# EAGLE design MorpheusMotor_1_1_0_AsFixed (EAGLE 5.11)
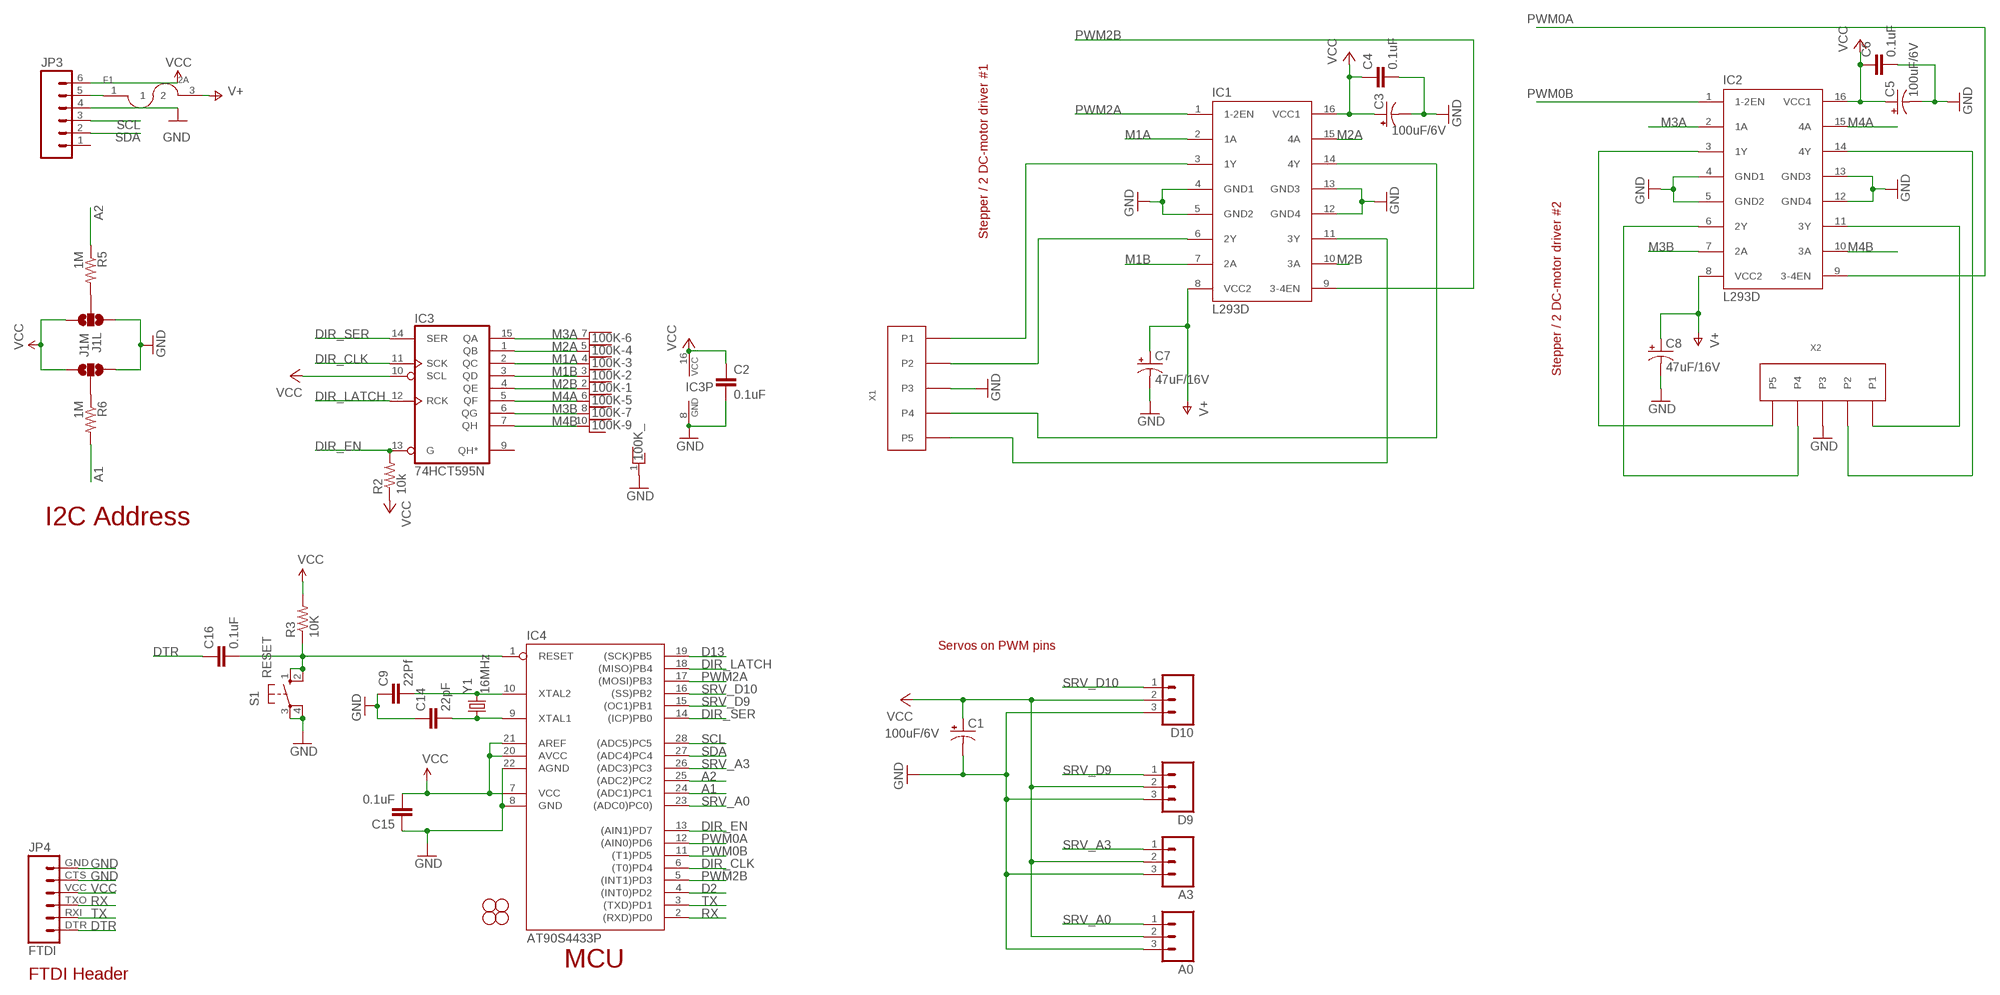
[diagram p0: schematic, sheet 1]

## Parts
100K  RNX9  [RN-10]
A0  M03PTH  [1X03]
A3  M03PTH  [1X03]
C1  100uF/6V  CAP_POLPTH1  [CPOL-RADIAL-100UF-25V]
C2  0.1uF  CAPPTH  [CAP-PTH-SMALL]
C3  100uF/6V  CAP_POLPTH1  [CPOL-RADIAL-100UF-25V]
C4  0.1uF  CAPPTH  [CAP-PTH-SMALL]
C5  100uF/6V  CAP_POLPTH1  [CPOL-RADIAL-100UF-25V]
C6  0.1uF  CAPPTH  [CAP-PTH-SMALL]
C7  47uF/16V  CAP_POLPTH1  [CPOL-RADIAL-100UF-25V]
C8  47uF/16V  CAP_POLPTH1  [CPOL-RADIAL-100UF-25V]
C9  22Pf  CAPPTH  [CAP-PTH-SMALL]
C14  22pF  CAPPTH  [CAP-PTH-SMALL]
C15  0.1uF  CAPPTH  [CAP-PTH-SMALL]
C16  0.1uF  CAPPTH  [CAP-PTH-SMALL]
D9  M03PTH  [1X03]
D10  M03PTH  [1X03]
F1  2A  FUSEX20MM  [FUSE_5MM]
IC1  L293D  L293E  [DIL16]
IC2  L293D  L293E  [DIL16]
IC3  74HCT595N  [DIL16]
IC4  AT90S4433P  [DIL28-3]
J1L  SOLDERJUMPER_2WAY-OLDT  [SJ_2]
J1M  SOLDERJUMPER_2WAY-OLDT  [SJ_2]
JP3  M06POLAR_LOCK  [MOLEX-1X6_LOCK]
JP4  FTDI  FTDI_BASICPTH  [FTDI_BASIC]
JP5  STAND-OFF  [STAND-OFF]
JP7  STAND-OFF  [STAND-OFF]
JP8  STAND-OFF  [STAND-OFF]
JP9  STAND-OFF  [STAND-OFF]
R2  10k  RESISTORPTH-1/4W  [AXIAL-0.4]
R3  10K  RESISTORPTH-1/4W  [AXIAL-0.4]
R5  1M  RESISTORPTH-1/4W  [AXIAL-0.4]
R6  1M  RESISTORPTH-1/4W  [AXIAL-0.4]
S1  RESET  10-XX  [B3F-10XX]
X1  TERM5  [TERM1X5]
X2  TERM5  [TERM1X5]
Y1  16MHz  CRYSTALHC49US  [HC49US]

## Nets
A1: IC4.24((ADC1)PC1) R6.P$2
A2: IC4.25((ADC2)PC2) R5.P$1
D2: IC4.4((INT0)PD2)
D13: IC4.19((SCK)PB5)
DIR_CLK: IC3.11(SCK) IC4.6((T0)PD4)
DIR_EN: IC3.13(G) IC4.13((AIN1)PD7) R2.P$2
DIR_LATCH: IC3.12(RCK) IC4.18((MISO)PB4)
DIR_SER: IC3.14(SER) IC4.14((ICP)PB0)
DTR: C16.1 JP4.DTR
GND [power]: 100K.1 A0.3 A3.3 C1.2(-) C2.2 C3.2(-) C4.2 C5.2(-) C6.2 C7.2(-) C8.2(-) C9.1 C14.1 C15.1 D9.3 D10.3 IC1.4(GND1) IC1.5(GND2) IC1.12(GND4) IC1.13(GND3) IC2.4(GND1) IC2.5(GND2) IC2.12(GND4) IC2.13(GND3) IC3.8(GND) IC4.8(GND) IC4.22(AGND) J1L.1 J1M.3 JP3.4 JP4.CTS JP4.GND S1.3(P) S1.4(P1) X1.P3 X2.P3
M1A: 100K.4 IC1.2(1A) IC3.2(QC)
M1B: 100K.3 IC1.7(2A) IC3.3(QD)
M2A: 100K.5 IC1.15(4A) IC3.1(QB)
M2B: 100K.2 IC1.10(3A) IC3.4(QE)
M3A: 100K.7 IC2.2(1A) IC3.15(QA)
M3B: 100K.8 IC2.7(2A) IC3.6(QG)
M4A: 100K.6 IC2.15(4A) IC3.5(QF)
M4B: 100K.10 IC2.10(3A) IC3.7(QH)
N$1 [power]: IC1.3(1Y) X1.P1
N$2: C16.2 IC4.1(RESET) R3.P$1 S1.1(S) S1.2(S1)
N$3: F1.1 JP3.5
N$4: J1L.2 R5.P$2
N$6: J1M.2 R6.P$1
N$7 [power]: IC2.3(1Y) X2.P5
N$8 [power]: IC2.6(2Y) X2.P4
N$9 [power]: IC2.11(3Y) X2.P1
N$20 [power]: IC2.14(4Y) X2.P2
N$31 [power]: IC1.6(2Y) X1.P2
N$32 [power]: IC1.11(3Y) X1.P5
N$33 [power]: IC1.14(4Y) X1.P4
PWM0A: IC2.9(3-4EN) IC4.12((AIN0)PD6)
PWM0B: IC2.1(1-2EN) IC4.11((T1)PD5)
PWM2A: IC1.1(1-2EN) IC4.17((MOSI)PB3)
PWM2B: IC1.9(3-4EN) IC4.5((INT1)PD3)
RX: IC4.2((RXD)PD0) JP4.TXO
SCL: IC4.28((ADC5)PC5) JP3.3
SDA: IC4.27((ADC4)PC4) JP3.2
SRV_A0: A0.1 IC4.23((ADC0)PC0))
SRV_A3: A3.1 IC4.26((ADC3)PC3)
SRV_D9: D9.1 IC4.15((OC1)PB1)
SRV_D10: D10.1 IC4.16((SS)PB2)
TX: IC4.3((TXD)PD1) JP4.RXI
V+ [power]: C7.1(+) C8.1(+) F1.3 IC1.8(VCC2) IC2.8(VCC2)
VCC [power]: A0.2 A3.2 C1.1(+) C2.1 C3.1(+) C4.1 C5.1(+) C6.1 C15.2 D9.2 D10.2 IC1.16(VCC1) IC2.16(VCC1) IC3.10(SCL) IC3.16(VCC) IC4.7(VCC) IC4.20(AVCC) IC4.21(AREF) J1L.3 J1M.1 JP3.6 JP4.VCC R2.P$1 R3.P$2
XTAL1: C14.2 IC4.9(XTAL1) Y1.1
XTAL2: C9.2 IC4.10(XTAL2) Y1.2
Unconnected: 100K.9 IC3.9(QH*) JP3.1

## Notes on the sheet
- Stepper / 2 DC-motor driver #1
- Stepper / 2 DC-motor driver #2
- I2C Address
- Servos on PWM pins
- MCU
- FTDI Header

## Library data of the parts
100K = resistor-net:RNX9: RESISTOR NETWORK
A0 A3 D9 D10 = SparkFun:M03: Header 3 Standard 3-pin 0.1" header. Use with straight break away headers (SKU : PRT-00116), right angle break away headers (PRT-00553), swiss pins (PRT-00743), machine pins (PRT-00117), and female headers (PRT-00115). Molex polarized connector foot print use with SKU : PRT-08232 with associated crimp pins and housings.
C1 C3 C5 C7 C8 = SparkFun:CAP_POL: Capacitor Polarized These are standard SMD and PTH capacitors. Normally 10uF, 47uF, and 100uF in electrolytic and tantalum varieties. Always verify the external diameter of the through hole cap, it varies with capacity, voltage, and manufacturer. The EIA devices should be standard.
C2 C4 C6 C9 C14-C16 = SparkFun:CAP: Capacitor Standard 0603 ceramic capacitor, and 0.1" leaded capacitor.
F1 = SparkFun:FUSE
IC1 IC2 = texas:L293E: TI DEVICE
IC3 = 74xx-eu:74*595: 8-bit SHIFT REGISTER, output latch
IC4 = atmel:AT90S4433: MICROCONTROLLER 4 Kbytes FLASH 128 bytes SRAM 256 bytes EEPROM UART 6-channel 10 bit ADC; OC_FARNELL: unknown; OC_NEWARK: unknown
J1L J1M = SparkFun:SOLDERJUMPER_2WAY-OLD: Solder Jumper 2 way solder jumper
JP3 = SparkFun:M06: Header 6 Standard 6-pin 0.1" header. Use with straight break away headers (SKU : PRT-00116), right angle break away headers (PRT-00553), swiss pins (PRT-00743), machine pins (PRT-00117), and female headers (PRT-00115). Molex polarized connector foot print use with SKU : PRT-08094 with associated crimp pins and housings. NOTES ON THE VARIANTS LOCK and LOCK_LONGPADS... This footprint was designed to help hold the alignment of a through-hole component (i.e. 6-pin header) while soldering it into place. You may notice that each hole has been shifted either up or down by 0.005 of an inch from it's more standard position (which is a perfectly straight line). This slight alteration caused the pins (the squares in the middle) to touch the edges of the holes. Because they are alternating, it causes a "brace" to hold the component in place. 0.005 has proven to be the perfect amount of "off-center" position when using our standard breakaway headers. Although looks a little odd when you look at the bare footprint, once you have a header in there, the alteration is very hard to notice. Also, if you push a header all the way into place, it is covered up entirely on the bottom side. This idea of altering the position of holes to aid alignment will be further integrated into the Sparkfun Library for other footprints. It can help hold any component with 3 or more connection pins.
JP4 = SparkFun:FTDI_BASIC: FTDI Basic: 3.3V and 5V
JP5 JP7-JP9 = SparkFun:STAND-OFF: Stand Off This is the mechanical footprint for a #4 phillips button head screw. Use the keepout ring to avoid running the screw head into surrounding components. SKU : PRT-00447
R2 R3 R5 R6 = SparkFun:RESISTOR: Resistor Basic schematic elements and footprints for 0603, 1206, and PTH resistors.
S1 = switch-omron:10-XX: OMRON SWITCH; MPN: B3F-1000; OC_FARNELL: 176432; OC_NEWARK: 36M3542
X1 X2 = mshield:TERM5
Y1 = SparkFun:CRYSTAL: Crystals Various standard crystals. Proven footprints. Spark Fun Electronics SKU : COM-00534

## Net classes
1 power: width 0.813 mm, clearance 0.508 mm

## Board
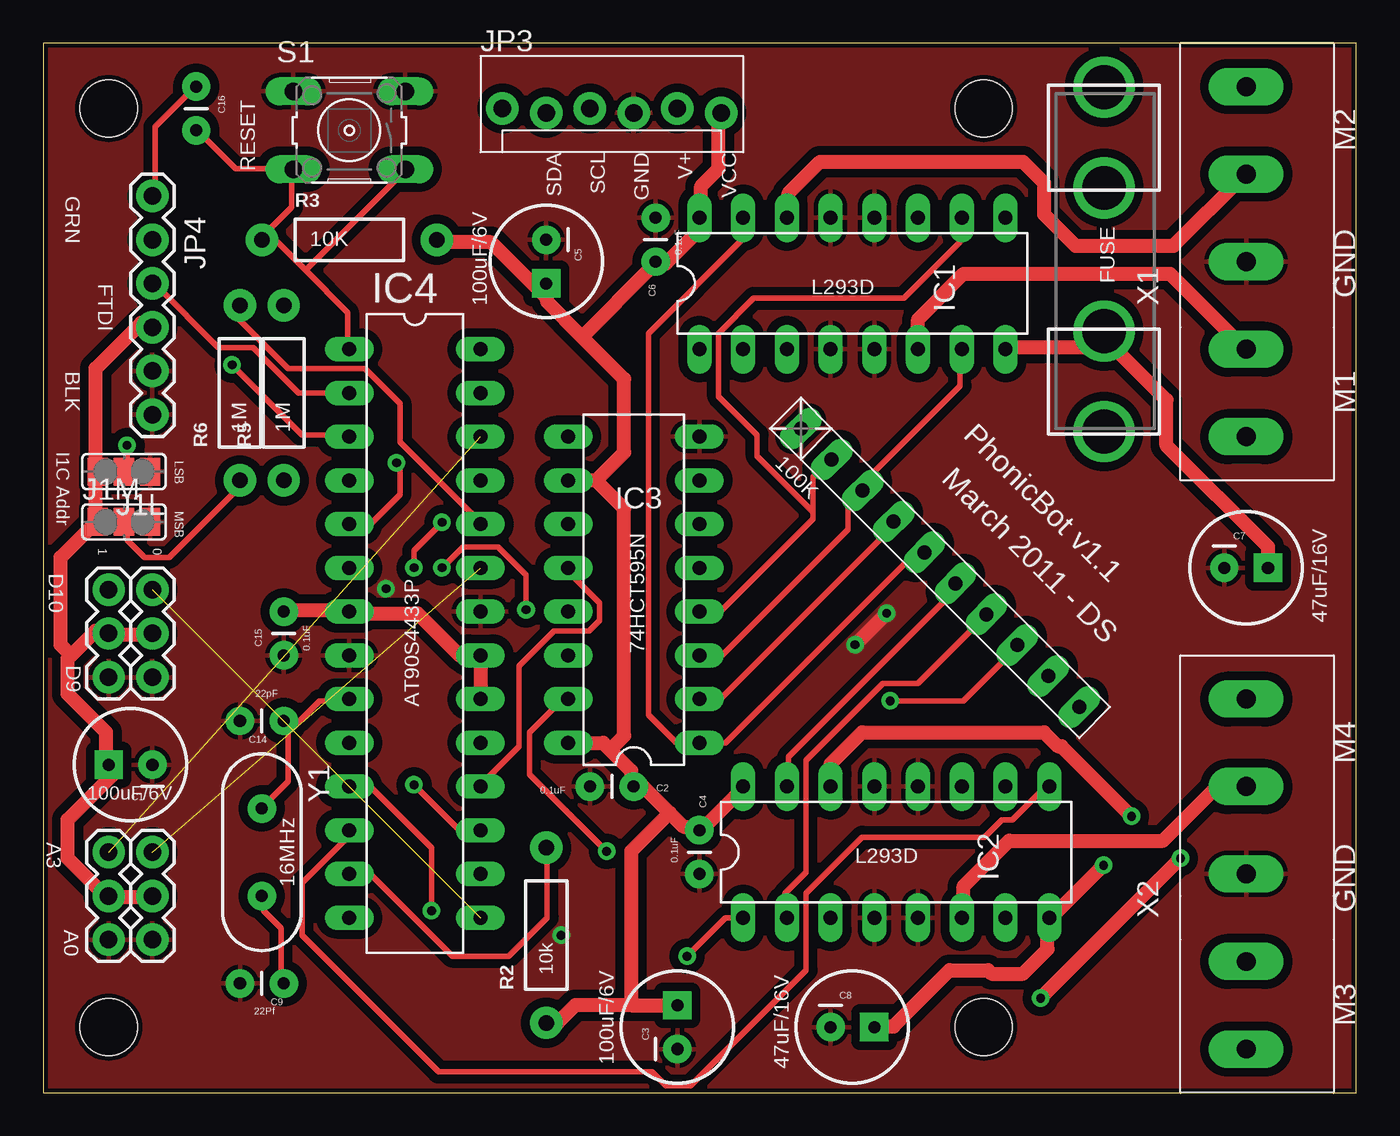
[diagram p1: board, top side]
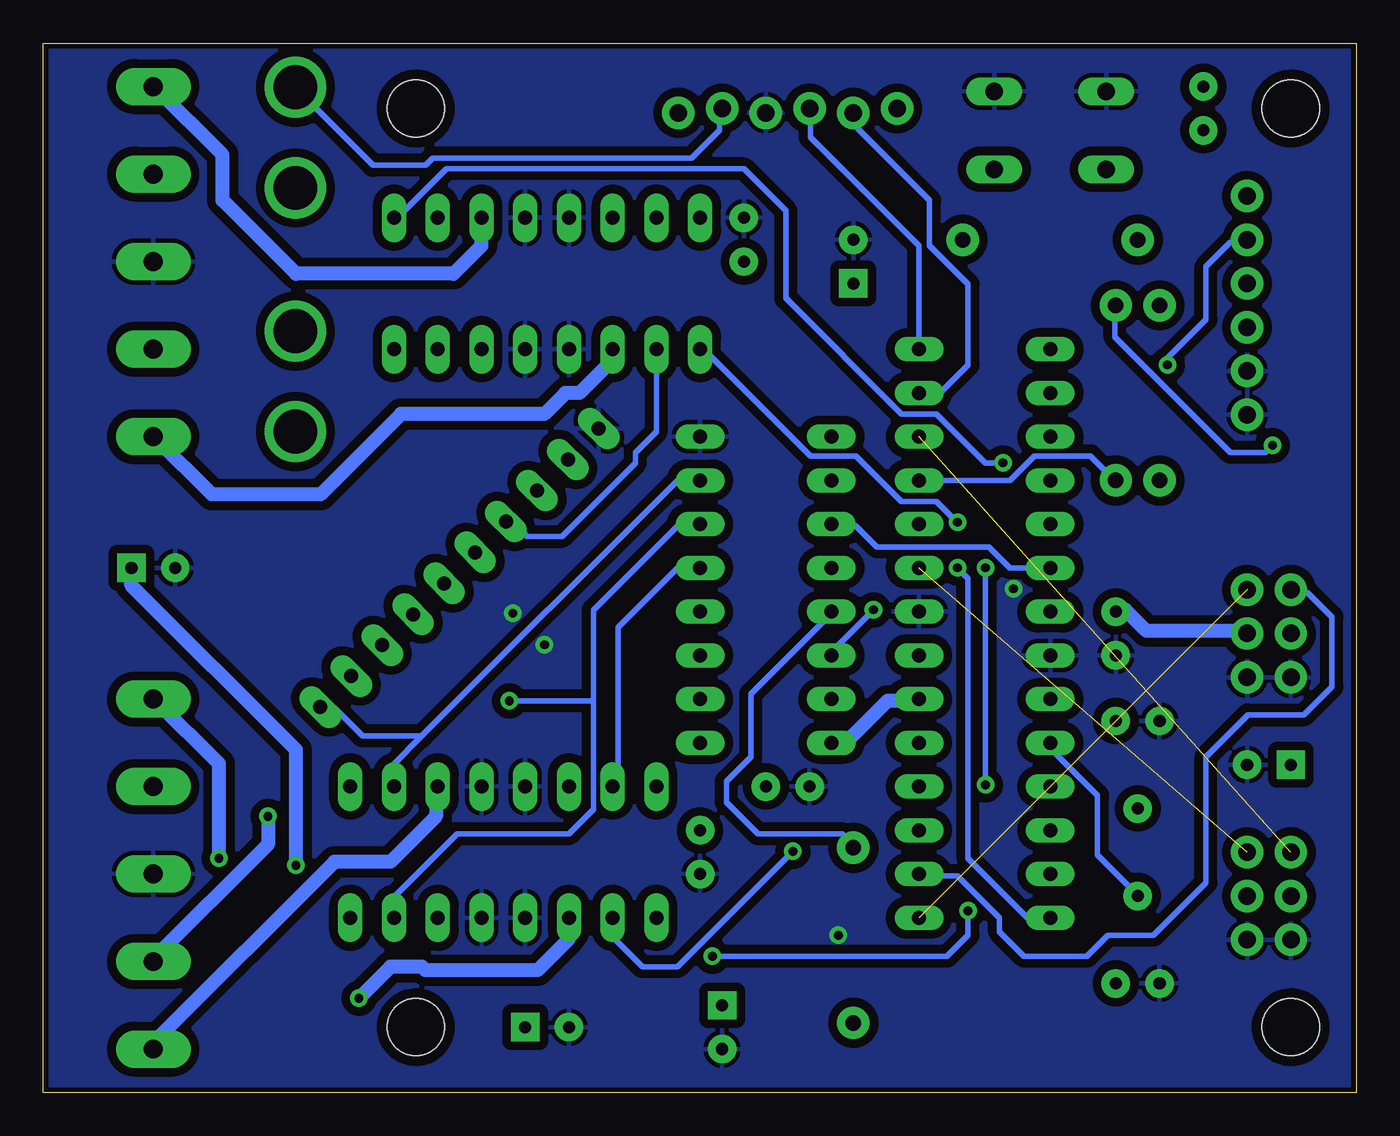
[diagram p2: board, bottom side, seen from below]

Size 76.25 x 60.95 mm. Coordinates in mm from the lower left corner, seen from the top.
Outline: 0,0 76.25,0 76.25,60.95 0,60.95 0,0
Copper layers (1*16): Top 0.035mm / dielectric 1.5mm / Bottom 0.035mm
Design rules "SparkFun": minimum track width 12mil, minimum drill 20mil, track to track 8mil, track to pad 8mil, pad to pad 8mil, via to via 8mil, smd to smd 8mil, copper to edge 10mil, drill to drill 8mil, minimum pad ring 12mil, minimum via ring 10mil, stop-mask expansion 4mil, vias tented up to drill 25mil, thermal gap 10mil

### Footprints (pad centres in the part's own frame; a part is rotated, then mirrored left to right if it is on the bottom)
RN-10 = drill 0.813 long: 1 -11.43,0; 2 -8.89,0; 3 -6.35,0; 4 -3.81,0; 5 -1.27,0; 6 1.27,0; 7 3.81,0; 8 6.35,0; 9 8.89,0; 10 11.43,0
1X03 = drill 1.016 pad 1.88 round: 1 0,0; 2 2.54,0; 3 5.08,0
CPOL-RADIAL-100UF-25V = drill 0.7 pad 1.651 square: 1 1.27,0 | drill 0.7 pad 1.651 round: 2 -1.27,0
CAP-PTH-SMALL = drill 0.7 pad 1.651 round: 1 0,0; 2 2.54,0
FUSE_5MM = drill 2.54 pad 3.556 round: 1 0,-10; 2 0,-4.158; 3 0,4.158; 4 0,10
DIL16 = drill 0.813 long: 1 -8.89,-3.81; 2 -6.35,-3.81; 3 -3.81,-3.81; 4 -1.27,-3.81; 5 1.27,-3.81; 6 3.81,-3.81; 7 6.35,-3.81; 8 8.89,-3.81; 9 8.89,3.81; 10 6.35,3.81; 11 3.81,3.81; 12 1.27,3.81; 13 -1.27,3.81; 14 -3.81,3.81; 15 -6.35,3.81; 16 -8.89,3.81
DIL28-3 = drill 0.813 long: 1 -16.51,-3.81; 2 -13.97,-3.81; 3 -11.43,-3.81; 4 -8.89,-3.81; 5 -6.35,-3.81; 6 -3.81,-3.81; 7 -1.27,-3.81; 8 1.27,-3.81; 9 3.81,-3.81; 10 6.35,-3.81; 11 8.89,-3.81; 12 11.43,-3.81; 13 13.97,-3.81; 14 16.51,-3.81; 15 16.51,3.81; 16 13.97,3.81; 17 11.43,3.81; 18 8.89,3.81; 19 6.35,3.81; 20 3.81,3.81; 21 1.27,3.81; 22 -1.27,3.81; 23 -3.81,3.81; 24 -6.35,3.81; 25 -8.89,3.81; 26 -11.43,3.81; 27 -13.97,3.81; 28 -16.51,3.81
SJ_2 = smd 1.168 x 1.6: 1 -1.524,0; 2 0,0; 3 1.524,0
MOLEX-1X6_LOCK = drill 1.016 pad 1.88 round: 1 0,0; 2 2.54,-0.254; 3 5.08,0; 4 7.62,-0.254; 5 10.16,0; 6 12.7,-0.254
FTDI_BASIC = drill 1.016 pad 1.88 round: CTS 10.16,0; DTR 0,0; GND 12.7,0; RXI 2.54,0; TXO 5.08,0; VCC 7.62,0
STAND-OFF = hole 3.302: 0,0
AXIAL-0.4 = drill 0.9 pad 1.88 round: P$1 -5.08,0; P$2 5.08,0
B3F-10XX = drill 1.016 long: 1 -3.251,2.261; 2 3.251,2.261; 3 -3.251,-2.261; 4 3.251,-2.261
TERM1X5 = drill 1.1 pad 2.184 long: P1 -10.16,0; P2 -5.08,0; P3 0,0; P4 5.08,0; P5 10.16,0
HC49US = drill 0.7 pad 1.651 round: 1 -2.54,0; 2 2.54,0

### Placement (x,y rotation side)
100K  52.07,30.48 315 top
A0  6.35,13.97 270 top
A3  3.81,13.97 270 top
C1  5.08,19.05 180 top
C2  34.29,17.78 180 top
C3  36.83,3.81 90 top
C4  38.1,15.24 270 top
C5  29.21,48.26 270 top
C6  35.56,48.26 90 top
C7  69.85,30.48 0 top
C8  46.99,3.81 0 top
C9  11.43,6.35 0 top
C14  11.43,21.59 0 top
C15  13.97,25.4 90 top
C16  8.89,58.42 270 top
D9  6.35,29.21 270 top
D10  3.81,29.21 270 top
F1  61.59,48.39 180 top
IC1  46.99,46.99 0 top
IC2  49.53,13.97 0 top
IC3  34.29,29.21 90 top
IC4  21.59,26.67 270 top
J1L  4.7,36.07 180 top
J1M  4.7,33.15 0 top
JP3  26.67,57.15 0 top
JP4  6.35,52.07 270 top
JP5  54.61,3.81 0 top
JP7  3.81,57.15 0 top
JP8  54.61,57.15 0 top
JP9  3.81,3.81 0 top
R2  29.21,9.14 90 top
R3  17.78,49.53 0 top
R5  13.97,40.64 90 top
R6  11.43,40.64 90 top
S1  17.78,55.88 180 top
X1  69.85,48.26 90 top
X2  69.85,12.7 90 top
Y1  12.7,13.97 270 top

### Tracks (layer width: path | path; a pad name or v marks a point on that pad's centre or on a via)
A1
  Top 0.305: IC4.24 25.4,33.12 20.73,37.8 20.73,40.03 18.69,42.06 14.22,42.06 11.38,44.91 11.38,45.72 R6.P$2
A2
  Bottom 0.305: IC4.25 20.12,35.56 18.69,36.98 15.44,36.98 14.02,35.56 R5.P$1
DIR_CLK
  Bottom 0.305: IC4.6 20.12,30.48 21.34,31.7 27.84,31.7 29.06,32.92 30.48,32.92 IC3.11
DIR_EN
  Top 0.305: IC4.13 17.88,12.6 19.1,12.6 23.77,7.92 27.03,7.92 29.26,10.16 29.26,14.22 R2.P$2
  Bottom 0.305: IC3.13 30.48,27.84 35.15,23.16 35.15,19.51 36.58,18.09 36.58,16.87 34.75,15.04 29.87,15.04 29.06,14.22 R2.P$2
DIR_LATCH
  Top 0.305: IC3.12 30.48,30.28 32.31,28.45 32.31,27.43 31.7,26.82 29.67,26.82 27.64,24.79 27.64,20.12 25.4,17.88 IC4.18
DIR_SER  (via drill 0.51)
  Top 0.305: v23.16,30.48 24.38,31.7 26.42,31.7 28.04,30.07 v28.04,28.04
  Bottom 0.305: v23.16,30.48 22.55,29.87 22.55,13.61 19.1,10.16 IC4.14 | v28.04,28.04 30.48,25.6 IC3.14
DTR
  Top 0.305: C16.1 8.74,58.32 6.5,56.08 6.5,52.22 JP4.DTR
GND  (via drill 0.51)
  Top 0.813: v47.14,26.01 v48.97,27.84
  other vias: 19.91,29.26 30.07,9.14
  pour Bottom (isolate 0.305): -1.27,62.23 77.47,62.23 77.47,-1.27 -1.27,-1.27
  pour Top: -2.54,-1.27 -2.54,62.23 77.47,62.23 77.47,-1.27
M1A
  Top 0.305: IC3.2 38.2,22.96 39.42,22.96 49.17,32.72 49.17,33.12 100K.4
  Bottom 0.305: IC1.2 40.64,38.41 41.86,37.19 41.86,36.58 46.13,32.31 48.16,32.31 49.17,33.33 100K.4
M1B
  Top 0.305: IC3.3 39.42,25.4 46.74,32.72 46.74,34.14 47.55,34.95 100K.3 47.75,35.15 47.75,35.56 53.24,41.05 53.24,43.08 IC1.7
M2A
  Top 0.305: 100K.5 51,31.29 50.6,31.29 39.62,20.32 IC3.1 36.78,20.32 35.15,21.95 35.15,44.09 40.64,49.58 IC1.15
M2B
  Top 0.305: 44.7,33.73 44.7,35.76 45.72,36.78 100K.2 | 44.7,33.73 44.7,33.33 39.42,28.04 38.2,28.04 IC3.4 | 44.7,33.73 41.45,36.98 41.45,38.2 39.22,40.44 39.22,44.09 41.25,46.13 49.99,46.13 53.24,49.38 53.24,50.8 IC1.10
M3A  (via drill 0.51)
  Top 0.305: v32.72,14.02 28.25,18.49 28.25,20.93 30.07,22.76 30.48,22.76 IC3.15 | 100K.7 54.66,27.64 50.8,23.77 48.77,23.77 44.3,19.3 44.3,12.8 43.08,11.58 43.08,10.16 IC2.2
  Bottom 0.305: v32.72,14.02 39.42,7.32 41.45,7.32 43.08,8.94 43.08,10.16 IC2.2
M3B  (via drill 0.51)
  Top 0.305: v49.17,22.76 53.44,22.76 56.49,25.81 100K.8
  Bottom 0.305: IC2.7 55.88,11.38 52.22,15.04 45.72,15.04 44.3,16.46 44.3,22.76 | 44.3,22.76 44.3,28.04 39.42,32.92 38.2,32.92 IC3.6 | 44.3,22.76 v49.17,22.76
M4A
  Top 0.305: IC2.15 43.28,17.88 43.28,19.51 52.83,29.06 52.83,29.46 100K.6
  Bottom 0.305: IC3.5 39.42,30.48 42.88,27.03 42.88,18.09 IC2.15
M4B
  Bottom 0.305: 54.36,20.62 55.88,19.1 IC2.10 | 54.36,20.62 39.42,35.56 IC3.7 | 100K.10 60.15,22.35 59.33,22.35 57.71,20.73 54.46,20.73 54.36,20.62
N$1
  Bottom 0.813: IC1.3 43.28,43.08 43.28,42.47 45.11,40.64 45.92,40.64 47.14,39.42 55.47,39.42 60.15,34.75 66.45,34.75 69.7,38 X1.P1
N$2
  Top 0.305: 15.24,47.75 13.61,49.38 12.8,49.38 R3.P$1 12.6,49.58 14.43,51.41 14.43,53.44 S1.2 14.43,53.65 11.18,53.65 8.94,55.88 C16.2 | 15.24,47.75 17.68,45.31 17.68,43.28 IC4.1 | 15.24,47.75 20.93,53.44 S1.1
N$3
  Bottom 0.305: JP3.5 36.98,57.1 36.98,55.88 38.61,54.25 53.65,54.25 54.05,53.85 57.1,53.85 61.57,58.32 F1.1
N$4  (via drill 0.51)
  Top 0.305: v4.88,37.59 4.88,36.17 J1L.2
  Bottom 0.305: v4.88,37.59 5.28,37.19 7.32,37.19 14.02,43.89 14.02,45.72 R5.P$2
N$6
  Top 0.305: J1M.2 4.88,33.12 4.88,32.11 5.89,31.09 7.32,31.09 11.38,35.15 11.38,35.56 R6.P$1
N$7  (via drill 0.51)
  Top 0.813: v57.91,5.49 v66.04,13.61
  Bottom 0.813: IC2.3 45.72,8.94 47.55,7.11 54.05,7.11 54.25,7.32 56.08,7.32 v57.91,5.49 | v66.04,13.61 66.04,19.1 69.7,22.76 X2.P5
N$8
  Top 0.813: IC2.6 53.44,10.16 53.44,11.99 56.08,14.63 65.02,14.63 68.07,17.68 69.7,17.68 X2.P4
N$9
  Bottom 0.813: IC2.11 53.44,17.68 53.44,16.05 56.08,13.41 59.33,13.41 69.7,3.05 69.7,2.64 X2.P1
N$20  (via drill 0.51)
  Top 0.813: v63.2,16.05 59.13,20.12 58.93,20.12 58.12,20.93 47.55,20.93 45.72,19.1 IC2.14
  Bottom 0.813: v63.2,16.05 63.2,14.43 69.9,7.72 X2.P2
N$31
  Top 0.813: IC1.6 50.8,44.91 53.44,47.55 65.43,47.55 69.7,43.28 X1.P2
N$32
  Bottom 0.813: IC1.11 50.8,49.17 52.43,47.55 61.57,47.55 65.84,51.82 65.84,54.46 69.7,58.32 X1.P5
N$33
  Top 0.813: IC1.14 43.28,50.8 43.28,52.22 45.11,54.05 56.9,54.05 58.12,52.83 58.12,51 59.94,49.17 65.63,49.17 69.7,53.24 X1.P4
PWM0A
  Top 0.305: IC4.12 17.68,15.24 17.68,14.83 15.04,12.19 15.04,9.14 22.96,1.22 35.36,1.22 36.17,0.41 37.59,0.41 44.3,7.11 44.3,11.58 47.55,14.83 54.66,14.83 55.68,15.85 56.29,15.85 58.32,17.88 IC2.9
PWM0B  (via drill 0.51)
  Top 0.305: v22.55,10.57 22.55,14.22 19.1,17.68 17.88,17.68 IC4.11 | v37.39,7.92 39.62,10.16 IC2.1
  Bottom 0.305: v22.55,10.57 22.55,9.14 23.77,7.92 v37.39,7.92
PWM2A  (via drill 0.51)
  Top 0.305: IC4.17 24.18,15.24 v21.54,17.88 | v21.54,30.48 21.54,31.5 v23.16,33.12
  Bottom 0.305: v21.54,17.88 v21.54,30.48 | v23.16,33.12 24.38,34.34 26.42,34.34 29.06,36.98 31.7,36.98 38,43.28 IC1.1
PWM2B  (via drill 0.51)
  Top 0.305: v20.52,36.58 20.73,36.37 20.73,34.75 19.1,33.12 17.88,33.12 IC4.5
  Bottom 0.305: v20.52,36.58 21.54,36.58 24.38,39.42 26.42,39.42 33.12,46.13 33.12,51.21 35.56,53.65 52.83,53.65 55.68,50.8 IC1.9
RX
  Top 0.305: IC4.2 14.83,40.64 12.19,43.28 10.16,43.28 6.5,46.94 JP4.TXO
SCL
  Bottom 0.305: IC4.28 25.4,49.17 31.7,55.47 31.7,57.1 JP3.3
SDA
  Bottom 0.305: IC4.27 24.18,40.64 22.55,42.27 22.55,46.94 24.79,49.17 24.79,51.82 29.06,56.08 29.06,56.9 JP3.2
SRV_A0  (1 unrouted)
SRV_A3  (1 unrouted)
SRV_D9  (1 unrouted)
SRV_D10
  Bottom 0.305: IC4.16 25.4,12.6 23.16,12.6 20.73,10.16 20.73,9.35 19.3,7.92 15.65,7.92 14.43,9.14 11.79,9.14 8.74,12.19 8.74,19.51 6.3,21.95 3.05,21.95 1.42,23.57 1.42,27.64 2.85,29.06 3.66,29.06 D10.1
TX  (via drill 0.51)
  Top 0.305: v10.97,42.27 15.04,38.2 17.68,38.2 IC4.3
  Bottom 0.305: v10.97,42.27 10.97,42.67 8.74,44.91 8.74,47.95 7.32,49.38 6.5,49.38 JP4.RXI
V+  (via drill 0.51)
  Top 0.813: C8.1 48.36,3.86 49.38,3.86 52.63,7.11 54.86,7.11 55.07,6.91 56.9,6.91 58.32,8.33 58.32,10.16 IC2.8 58.73,10.36 v61.57,13.21 | IC1.8 55.88,43.28 60.76,43.28 61.57,44.09 F1.3 61.57,43.89 65.23,40.23 65.23,37.59 71.12,31.7 C7.1
  Bottom 0.813: v61.57,13.21 61.57,19.91 71.12,29.46 C7.1
VCC
  Top 0.813: JP3.6 39.22,56.9 39.22,53.65 38.2,52.63 38.2,51 IC1.16 38,50.8 38,49.99 36.17,48.16 35.56,48.16 C6.1 35.36,47.95 31.29,43.89 | 32.11,35.56 IC3.10 | 32.11,35.56 33.73,37.19 33.73,41.45 31.29,43.89 | 31.29,43.89 29.26,45.92 29.26,46.94 C5.1 29.06,46.33 26.01,49.38 22.96,49.38 R3.P$2 | JP4.VCC 6.1,44.7 5.69,44.7 3.05,42.06 3.05,36.37 J1L.3 3.05,35.97 3.05,33.33 J1M.1 2.85,32.92 1.02,31.09 1.02,26.01 1.63,25.4 | A0.2 6.3,11.38 3.86,11.38 A3.2 3.45,11.58 1.42,13.61 1.42,15.85 4.06,18.49 4.06,18.9 C1.1 3.66,19.1 3.66,20.93 1.42,23.16 1.42,25.2 1.63,25.4 | 1.63,25.4 3.05,26.82 3.66,26.82 D10.2 4.06,26.62 6.3,26.62 D9.2 | 34.14,5.08 30.89,5.08 29.87,4.06 R2.P$1 | 34.14,5.08 C3.1 | IC2.16 40.64,17.68 38.2,15.24 C4.1 37.8,15.44 37.19,15.44 36.37,16.26 | C15.2 14.02,28.04 17.68,28.04 IC4.7 18.09,27.84 21.74,27.84 24.18,25.4 IC4.21 IC4.20 | IC3.16 32.51,20.32 32.92,19.91 | 32.92,19.91 34.14,18.69 34.14,17.88 C2.1 34.54,18.09 36.37,16.26 | 34.14,5.08 34.14,14.02 36.37,16.26 | 32.11,35.56 33.73,33.93 33.73,20.73 32.92,19.91
  Bottom 0.813: IC3.16 29.67,20.32 27.23,22.76 25.4,22.76 IC4.20 | D9.2 6.5,26.82 12.19,26.82 13.41,28.04 13.82,28.04 C15.2
XTAL1
  Top 0.305: 14.22,21.54 14.02,21.54 C14.2 14.22,21.54 | 14.22,21.54 14.83,21.54 16.05,22.76 17.68,22.76 IC4.9 | 14.22,21.54 14.22,18.09 12.8,16.66 Y1.1
XTAL2
  Top 0.305: C9.2 13.82,6.5 13.82,9.55 12.8,10.57 12.8,11.38 Y1.2
  Bottom 0.305: IC4.10 17.68,20.32 17.68,19.91 15.04,17.27 15.04,13.82 12.8,11.58 Y1.2

### Text on the board
tPlace: M2 | SDA | SCL | GND | V+ | VCC | GRN | GND | FUSE | BLK | M1 | PhonicBot v1.1 | I1C Addr | LSB | March 2011 - DS | MSB | 1 | 0 | M4 | GND | M3